# Altium schematic sheet Other_Componentt.SchDoc
size A4; Date: 14.09.2021; Author: İzzet Emre KARSAVURAN; Revision: 1; SheetNumber: 2; SheetTotal: 5; Authot_Mail: iekarsavuran@gmail.com; Project_Name: Burglar Alarm System; Size: A3
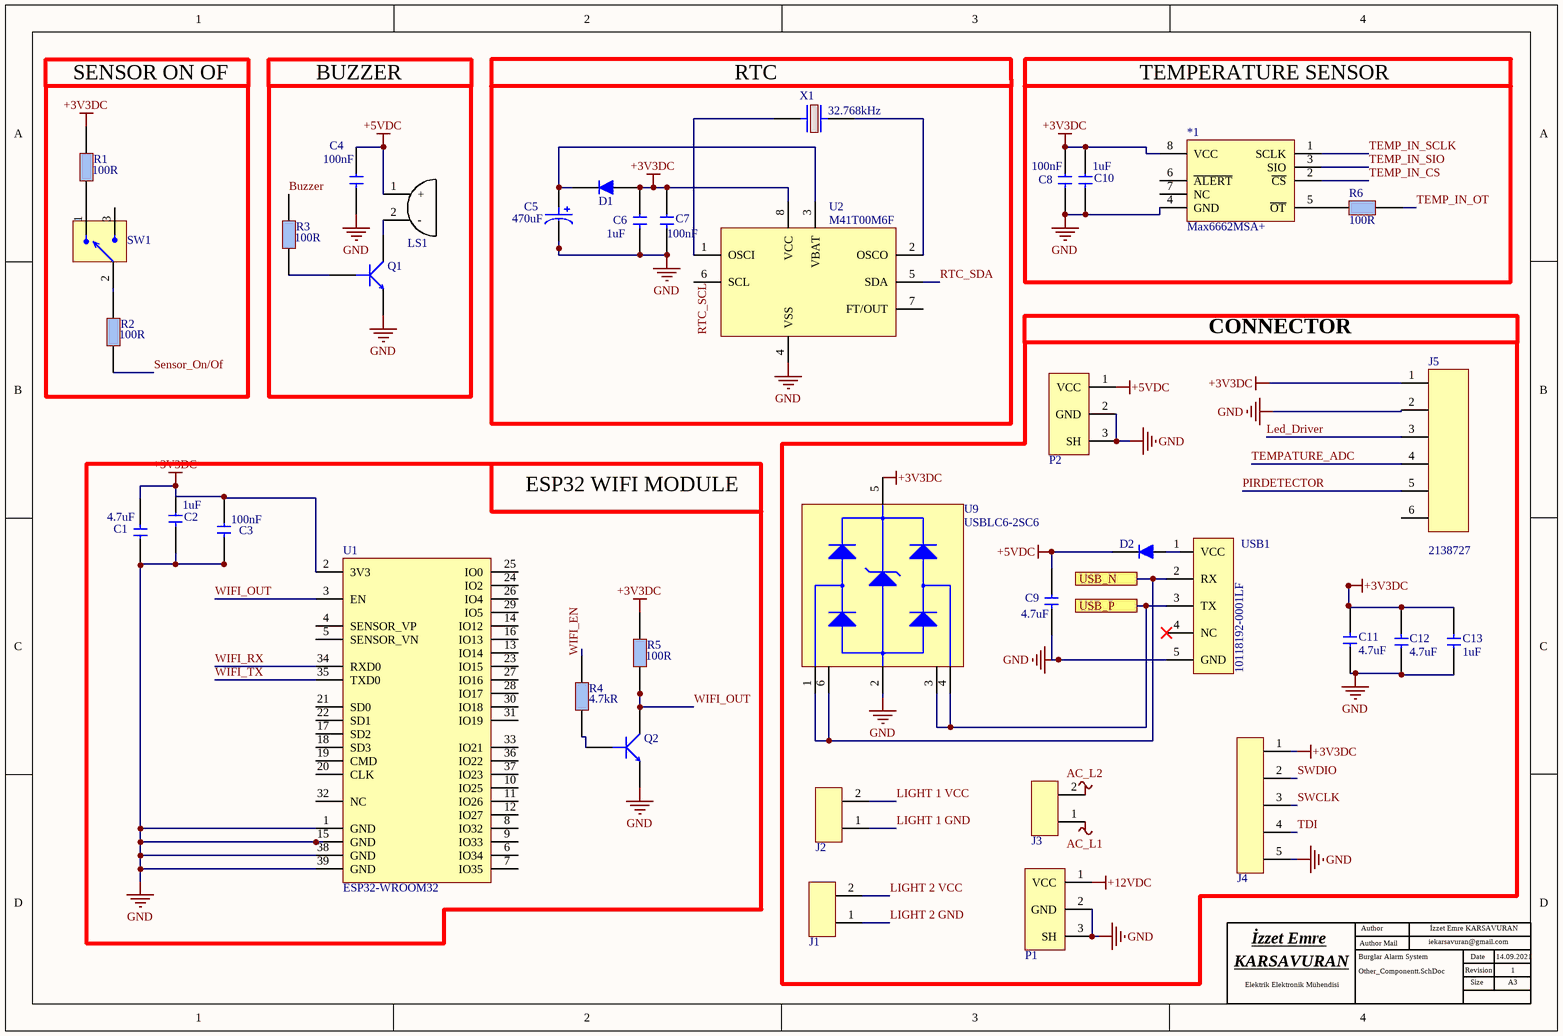
[diagram p0: Other_Componentt.SchDoc]

## Parts
*1  Max6662MSA+  [SOIC8]
C1  Capacitance: 4.7uF  [CAP_0805]  (hidden comment: CL21A475KAQNNNE)
C2  Capacitance: 1uF  [CAP_0805]  (hidden comment: CL21B105KBFNNNE)
C3  Capacitance: 100nF  [CAP_0805]  (hidden comment: CL21B104KBCNNNC)
C4  Capacitance: 100nF  [CAP_0805]  (hidden comment: CL21B104KBCNNNC)
C5  Capacitance: 470uF  [CAP_RADIAL_D10_P5]  (hidden comment: ESH477M050AH4AA)
C6  Capacitance: 1uF  [CAP_0805]  (hidden comment: CL21B105KBFNNNE)
C7  Capacitance: 100nF  [CAP_0805]  (hidden comment: CL21B104KBCNNNC)
C8  Capacitance: 100nF  [CAP_0805]  (hidden comment: CL21B104KBCNNNC)
C9  Capacitance: 4.7uF  [CAP_0805]  (hidden comment: CL21A475KAQNNNE)
C10  Capacitance: 1uF  [CAP_0805]  (hidden comment: CL21B105KBFNNNE)
C11  Capacitance: 4.7uF  [CAP_0805]  (hidden comment: CL21A475KAQNNNE)
C12  Capacitance: 4.7uF  [CAP_0805]  (hidden comment: CL21A475KAQNNNE)
C13  Capacitance: 1uF  [CAP_0805]  (hidden comment: CL21B105KBFNNNE)
D1  1N4148WS  [SOT23-F]  (value not drawn)
D2  1N4148WS  [SOT23-F]  (value not drawn)
J1  TBP01R1-508-02BE  [TBP01R1-508]  (value not drawn)
J2  TBP01R1-508-02BE  [TBP01R1-508]  (value not drawn)
J3  TBP01R1-508-02BE  [TBP01R1-508]  (value not drawn)
J4  SMH-105-02-L-S  [PINHEADER1X5_RA]  (value not drawn)
J5  Supplier Part Number 1: 2138727  [64800611622]  (hidden comment: 64800611622)
LS1  CMI-9605IC-0580T  [CMI-9605IC-0580T]  (value not drawn)
P1  PJ-037AH-SMT-TR  [JACK]  (value not drawn)
P2  PJ-037AH-SMT-TR  [JACK]  (value not drawn)
Q1  MMBT3904-7-F  [SOT23-F]  (value not drawn)
Q2  MMBT3904-7-F  [SOT23-F]  (value not drawn)
R1  Resistance: 100R  [RES_0603]  (hidden comment: RC0603JR-07100RL)
R2  Resistance: 100R  [RES_0603]  (hidden comment: RC0603JR-07100RL)
R3  Resistance: 100R  [RES_0603]  (hidden comment: RC0603JR-07100RL)
R4  Resistance: 4.7kR  [RES_0603]  (hidden comment: RC0603JR-074K7L)
R5  Resistance: 100R  [RES_0603]  (hidden comment: RC0603JR-07100RL)
R6  Resistance: 100R  [RES_0603]  (hidden comment: RC0603JR-07100RL)
SW1  EG1215AA  [EG1215AA]  (value not drawn)
U1  ESP32-WROOM32  [ESP-32]
U2  M41T00M6F  [SOIC8]
U9  USBLC6-2SC6  [SOT23-6L]
USB1  10118192-0001LF  [Micro_Usb_B]
X1  Frequency: 32.768kHz  [ABS05]  (hidden comment: ABS05-32.768KHZ-T)

## Blocks framed on the sheet
SENSOR ON OF: R1 R2 SW1
BUZZER: C4 LS1 Q1 R3
TEMPERATURE SENSOR: *1 C8 C10 R6
CONNECTOR: C9 C11-C13 D2 J1-J5 P1 P2 U9 USB1
ESP32 WIFI MODULE: C1-C3 Q2 R4 R5 U1

## Ports
USB_N, USB_P

## Nets
+3V3DC: *1.8(VCC) C1.2 C2.1 C3.1 C6.1 C7.1 C8.1 C10.1 C11.2 C12.2 C13.2 D1.2 J4.1 J5.1 R1.2 R5.2 U1.2(3V3) U2.8(VCC) U9.5(VBUS)
+5VDC: C4.1 C9.1 D2.1 LS1.1(+) P2.1(VCC)
+12VDC: P1.1(VCC)
AC_L1: J3.1
AC_L2: J3.2
GND: *1.4(GND) C1.1 C2.2 C3.2 C4.2 C5.2 C6.2 C7.2 C8.2 C9.2 C10.2 C11.1 C12.1 C13.1 J4.5 J5.2 P1.2(GND) P1.3(SH) P2.2(GND) P2.3(SH) Q1.2(E) Q2.2(E) U1.1(GND) U1.15(GND) U1.38(GND) U1.39(GND) U2.4(VSS) U9.2(GND) USB1.5(GND)
Buzzer: R3.2
Led_Driver: J5.3
LIGHT 1 GND: J2.1
LIGHT 1 VCC: J2.2
LIGHT 2 GND: J1.1
LIGHT 2 VCC: J1.2
PIRDETECTOR: J5.5
RTC_SCL: U2.6(SCL)
RTC_SDA: U2.5(SDA)
Sensor_On/Of: R2.1
SWCLK: J4.3
SWDIO: J4.2
TDI: J4.4
TEMP_IN_CS: *1.2(~{CS})
TEMP_IN_OT: R6.1
TEMP_IN_SCLK: *1.1(SCLK)
TEMP_IN_SIO: *1.3(SIO)
TEMPATURE_ADC: J5.4
USB_N: U9.1(I/O1) U9.6(I/O1) USB1.2(RX) ; port USB_N
USB_P: U9.3(I/O2) U9.4(I/O2) USB1.3(TX) ; port USB_P
WIFI_EN: R4.2
WIFI_OUT: Q2.3(C) R5.1 U1.3(EN)
WIFI_RX: U1.34(RXD0)
WIFI_TX: U1.35(TXD0)
Net*1_5: *1.5(~{OT}) R6.2
NetC5_1: C5.1 D1.1 U2.3(VBAT)
NetD2_2: D2.2 USB1.1(VCC)
NetLS1_2: LS1.2(-) Q1.3(C)
NetQ1_1: Q1.1(B) R3.1
NetQ2_1: Q2.1(B) R4.1
NetR1_1: R1.1 SW1.1
NetR2_2: R2.2 SW1.2
NetU2_1: U2.1(OSCI) X1.1
NetU2_2: U2.2(OSCO) X1.2

Not connected (* = marked no-connect by the designer): *1 6(~{ALERT}) 7(NC); J5 6; SW1 3; U1 4(SENSOR_VP) 5(SENSOR_VN) 6(IO34) 7(IO35) 8(IO32) 9(IO33) 10(IO25) 11(IO26) 12(IO27) 13(IO14) 14(IO12) 16(IO13) 17(SD2) 18(SD3) 19(CMD) 20(CLK) 21(SD0) 22(SD1) 23(IO15) 24(IO2) 25(IO0) 26(IO4) 27(IO16) 28(IO17) 29(IO5) 30(IO18) 31(IO19) 32(NC) 33(IO21) 36(IO22) 37(IO23); U2 7(FT/OUT); USB1 4(NC)*

## Notes on the sheet
- (near X1) RTC
- KARSAVURAN <https://github.com/iek21?>
- Elektrik Elektronik Mühendisi
- İzzet Emre <https://www.linkedin.com/in/izzet-emre-karsavuran-24704417b>
- Author Mail
- Author
- Revision
- Date
- Size

## Library data of the parts
*1 = Max6662MSA+: Temp Sensor Digital Serial (3-Wire, SPI) 8-Pin SOIC N Tube; Manufacturer: Maxim; Designed By: İzzet Emre KARSAVURAN; Output Type: Digital,SPI; Max Supply Voltage (DC): 5.5V; Min Supply Voltage (DC): 3V; Resolution: 12b; Max Power Dissipation: 471mW; Operating Supply Current: 600uA; Number of Bits: 12; Package: SOIC8; Supplier 1: Digi-Key; Manufacturer Part Number: MAX6662MSA+; RoHS: Yes; Category: Temperature and Humidity Sensors; Stock 1: 649; Pricing 1: 1=3,20000, 10=2,87000, 25=2,71360, 100=2,35170, 500=2,00196, 1000=1,78220 (USD); Case/Package: SOIC; Number of Pins: 8; Min Operating Temperature: -55°C; Max Operating Temperature: 150°C; Interface: SPI; Packaging: Rail/Tube; Package Quantity: 100; Series: MAX6662; Max Supply Voltage: 5.5V; Min Supply Voltage: 3V; Length: 5mm; Width: 4mm; Height: 1.5mm; Radiation Hardening: No; RoHS Compliant: Yes; Lead Free: Lead Free; REACH SVHC: Unknown; ComponentLink1URL: https://datasheet.ciiva.com/5299/max6662-89142-5299456.pdf?src-supplier=Mouser; ComponentLink1Description: https://datasheet.ciiva.com/5299/max6662-89142-5299456.pdf?src-supplier=Mouser; ComponentLink2URL: https://datasheet.ciiva.com/16635/max6662-16635842.pdf?src-supplier=Avnet+Europe; ComponentLink2Description: https://datasheet.ciiva.com/16635/max6662-16635842.pdf?src-supplier=Avnet+Europe; ComponentLink3URL: https://datasheet.ciiva.com/3277/max6662-3277979.pdf?src-supplier=Avnet; ComponentLink3Description: https://datasheet.ciiva.com/3277/max6662-3277979.pdf?src-supplier=Avnet; ComponentLink4URL: https://datasheet.ciiva.com/2003/max6662-2003390.pdf?src-supplier=Digi-Key; ComponentLink4Description: https://datasheet.ciiva.com/2003/max6662-2003390.pdf?src-supplier=Digi-Key; Supplier Part Number 1: MAX6662MSA+-ND
C1 C9 C11 C12 = CAP CER 4.7uF: SAMSUNG ELECTRO-MECHANICS - CL21A475KAQNNNE - SMD Multilayer Ceramic Capacitor, 4.7 µF, 25 V, 0805 [2012 Metric], ± 10%, X5R, CL Series; Designed By: İzzet Emre KARSAVURAN; Voltage Rating: 25V; Supplier 1: Digi-Key; Manufacturer: Samsung; Manufacturer Part Number: CL21A475KAQNNNE; RoHS: Yes; Category: Ceramic Capacitors; Stock 1: 340871; Pricing 1: 1=0,12000, 10=0,08300, 50=0,04720, 100=0,03910, 500=0,02742, 1000=0,02271 (USD); Mount: Surface Mount; Case/Package: 0805; Case Code (Metric): 2012; Case Code (Imperial): 0805; Min Operating Temperature: -55°C; Max Operating Temperature: 85°C; Package Quantity: 1; Packaging: Tape and Reel; Tolerance: 10%; Dielectric: X5R; Voltage Rating (DC): 25V; Series: CL; Construction: Flat; Length: 2mm; Width: 0.049inch; Height: 1.25mm; Thickness: 0.055inch; Depth: 1.25mm; Radiation Hardening: No; Lead Free: Lead Free; RoHS Compliant: Yes; ComponentLink1URL: https://datasheet.ciiva.com/25798/cl21a475kaqnnne-25798882.pdf?src-supplier=Digi-Key; ComponentLink1Description: https://datasheet.ciiva.com/25798/cl21a475kaqnnne-25798882.pdf?src-supplier=Digi-Key; Supplier Part Number 1: 1276-1244-1-ND
C2 C6 C10 C13 = CAP CER 1uF: SAMSUNG ELECTRO-MECHANICS - CL21B105KBFNNNE - SMD Multilayer Ceramic Capacitor, 1 µF, 50 V, 0805 [2012 Metric], ± 10%, X7R, CL Series; Designed By: İzzet Emre KARSAVURAN; Voltage Rating: 50V; Supplier 1: Digi-Key; Manufacturer: Samsung; Manufacturer Part Number: CL21B105KBFNNNE; RoHS: Yes; Category: Ceramic Capacitors; Pricing 1: 1=0,13000, 10=0,09000, 50=0,05120, 100=0,04250, 500=0,02978, 1000=0,02465 (USD); Mount: Surface Mount; Case/Package: 0805; Case Code (Metric): 2012; Case Code (Imperial): 0805; Min Operating Temperature: -55°C; Max Operating Temperature: 125°C; Tolerance: 10%; Packaging: Tape and Reel; Package Quantity: 1; Dielectric: X7R; Voltage: 50V; Series: CL; Construction: Flat; Length: 2mm; Width: 0.049inch; Height: 1.25mm; Thickness: 0.053inch; Depth: 1.25mm; Radiation Hardening: No; RoHS Compliant: Yes; ComponentLink1URL: https://datasheet.ciiva.com/25800/cl21b105kbfnnne-25800291.pdf?src-supplier=Digi-Key; ComponentLink1Description: https://datasheet.ciiva.com/25800/cl21b105kbfnnne-25800291.pdf?src-supplier=Digi-Key; ComponentLink2URL: https://datasheet.ciiva.com/16449/cl21b105kbfnnne-16449003.pdf?src-supplier=Future+Electronics; ComponentLink2Description: https://datasheet.ciiva.com/16449/cl21b105kbfnnne-16449003.pdf?src-supplier=Future+Electronics; ComponentLink3URL: https://datasheet.ciiva.com/26838/getdatasheetpartid-354075-26838668.pdf?src-supplier=Verical; ComponentLink3Description: https://datasheet.ciiva.com/26838/getdatasheetpartid-354075-26838668.pdf?src-supplier=Verical; Supplier Part Number 1: 1276-1029-6-ND
C3 C4 C7 C8 = CAP CER 100nF-0803: Samsung Electro-Mechanics 100nF Multilayer Ceramic Capacitor (MLCC) 50 V 10% X7R dielectric CL max op. temp. +125C; Designed By: İzzet Emre KARSAVURAN; Voltage Rating: 50V; Supplier 1: Digi-Key; Manufacturer: Samsung; Manufacturer Part Number: CL21B104KBCNNNC; RoHS: Yes; Category: Ceramic Capacitors; Pricing 1: 1=0,10000, 10=0,05000, 50=0,02740, 100=0,02240, 500=0,01598, 1000=0,01256 (USD); Mount: Surface Mount; Case/Package: 0805; Case Code (Metric): 2012; Case Code (Imperial): 0805; Material: Ceramic; Contact Plating: Tin; Min Operating Temperature: -55°C; Max Operating Temperature: 125°C; Tolerance: 10%; Dielectric: X7R; Packaging: Tape and Reel; Voltage: 50V; Voltage Rating (DC): 50V; Series: CL; Construction: Flat; Length: 2mm; Width: 0.049inch; Height: 0.85mm; Depth: 1.25mm; Thickness: 0.037inch; Radiation Hardening: No; Lead Free: Lead Free; RoHS Compliant: Yes; ComponentLink1URL: https://datasheet.ciiva.com/25710/cl21b104kbcnnnc-25710182.pdf?src-supplier=Digi-Key; ComponentLink1Description: https://datasheet.ciiva.com/25710/cl21b104kbcnnnc-25710182.pdf?src-supplier=Digi-Key; ComponentLink2URL: https://datasheet.ciiva.com/29199/454152-da-01-en-vs-kondensator-0805-29199814.pdf?src-supplier=Conrad; ComponentLink2Description: https://datasheet.ciiva.com/29199/454152-da-01-en-vs-kondensator-0805-29199814.pdf?src-supplier=Conrad; Supplier Part Number 1: 1276-1003-6-ND
C5 = CAP ALU ELEC 470uF 50V: Cap, 470UF, 50V, Alu Elec, Radial; Manufacturer: KEMET; Polarity: Polar; Tolerance: 20%; Life (Hours): 2000Hour; Designed By: İzzet Emre KARSAVURAN; Supplier 1: Digi-Key; Manufacturer Part Number: ESH477M050AH4AA; RoHS: Yes; Pricing 1: 1=0,59000, 10=0,41700, 50=0,31540, 100=0,27470, 500=0,20350, 1000=0,17298, 2500=0,16280, 5000=0,15262 (USD); Mount: Through Hole; Case/Package: Radial; Min Operating Temperature: -40°C; Max Operating Temperature: 105°C; Packaging: Bulk; Voltage Rating: 50V; RoHS Compliant: No; ComponentLink1URL: https://api.kemet.com/component-edge/download/datasheet/ESH477M050AH4AA.pdf?src-supplier=Digi-Key; ComponentLink1Description: https://api.kemet.com/component-edge/download/datasheet/ESH477M050AH4AA.pdf?src-supplier=Digi-Key; Supplier Part Number 1: 399-15683-ND
D1 D2 = 1N4148WS: ON SEMICONDUCTOR - 1N4148WS - Small Signal Diode, Single, 75 V, 150 mA, 1 V, 4 ns; Manufacturer: ON Semiconductor / Fairchild; Designed By: İzzet Emre KARSAVURAN; Forward Current: 150mA; Max Repetitive Reverse Voltage (Vrrm): 75V; Forward Voltage: 1V; Reverse Recovery Time: 4ns; Power Dissipation: 200mW; Max Reverse Current: 5uA; Max Forward Surge Current (Ifsm): 2A; Supplier 1: Digi-Key; Manufacturer Part Number: 1N4148WS; RoHS: Yes; Category: Rectifier Diodes; Pricing 1: 1=0,21000, 10=0,19200, 100=0,10460, 500=0,06436, 1000=0,04388 (USD); Mount: Surface Mount; Number of Pins: 2; Contact Plating: Tin,Matte; Weight: 0.0276g; Min Operating Temperature: -55°C; Max Operating Temperature: 150°C; Packaging: Tape and Reel; Element Configuration: Single; Package Quantity: 1; Average Rectified Current: 150mA; Max Reverse Voltage (DC): 75V; Recovery Time: 4ns; Series: -; Reverse Voltage: 75V; Length: 1.8mm; Width: 1.35mm; Height: 1mm; Radiation Hardening: No; RoHS Compliant: Yes; REACH SVHC: No SVHC; Lead Free: Lead Free; ComponentLink1URL: https://datasheet.ciiva.com/25968/1n914bws-25968945.pdf?src-supplier=Avnet+Europe; ComponentLink1Description: https://datasheet.ciiva.com/25968/1n914bws-25968945.pdf?src-supplier=Avnet+Europe; ComponentLink2URL: https://datasheet.ciiva.com/30479/0900766b810e1cd3-30479206.pdf?src-supplier=RSComponents; ComponentLink2Description: https://datasheet.ciiva.com/30479/0900766b810e1cd3-30479206.pdf?src-supplier=RSComponents; ComponentLink3URL: https://datasheet.ciiva.com/8300/1n914bws-8300360.pdf?src-supplier=Avnet; ComponentLink3Description: https://datasheet.ciiva.com/8300/1n914bws-8300360.pdf?src-supplier=Avnet; ComponentLink4URL: https://datasheet.ciiva.com/15208/getdatasheetpartid-127819-15208358.pdf?src-supplier=Verical; ComponentLink4Description: https://datasheet.ciiva.com/15208/getdatasheetpartid-127819-15208358.pdf?src-supplier=Verical; ComponentLink5URL: https://datasheet.ciiva.com/910/1n4148ws-910381.pdf?src-supplier=Digi-Key; ComponentLink5Description: https://datasheet.ciiva.com/910/1n4148ws-910381.pdf?src-supplier=Digi-Key; ComponentLink6URL: https://datasheet.ciiva.com/910/1n4148ws-910382.pdf?src-supplier=Digi-Key; ComponentLink6Description: https://datasheet.ciiva.com/910/1n4148ws-910382.pdf?src-supplier=Digi-Key; ComponentLink7URL: https://datasheet.ciiva.com/910/1n4148ws-910380.pdf?src-supplier=Digi-Key; ComponentLink7Description: https://datasheet.ciiva.com/910/1n4148ws-910380.pdf?src-supplier=Digi-Key; Case/Package: SOC323F; Supplier Part Number 1: 1N4148WSFSCT-ND
J1-J3 = TBP01R1-508-02BE: Conn Shrouded Header HDR 2 POS 5.08mm Solder RA Side Entry Thru-Hole Bag; Manufacturer: CUI; Designed By: İzzet Emre KARSAVURAN; Supplier 1: Future Electronics; Manufacturer Part Number: TBP01R1-508-02BE; RoHS: Yes; Supplier Part Number 1: 1117528; Case/Package: TBP01R1-508
J4 = SMH-105-02-L-S: .100 C.L. HORIZONTAL SMT SOCKET; Manufacturer: Samtec; Designed By: İzzet Emre KARSAVURAN; Number of Contacts: 4; Gender: Receptacle; Contact Resistance: 10mR; Pitch: 2.54mm; Supplier 1: Digi-Key; Manufacturer Part Number: SMH-105-02-L-S; RoHS: Yes; Category: Headers and Wire Housings; Pricing 1: 1=2,01000, 10=1,75200, 80=1,56550, 440=1,30464, 945=1,11825, 4900=0,99400 (USD); Contact Plating: Gold; Contact Material: Bronze; Housing Color: Black; Housing Material: Polymer; Min Operating Temperature: -55°C; Max Operating Temperature: 125°C; Number of Rows: 1; Termination: Solder; Packaging: Rail/Tube; Orientation: Horizontal; Length: 13.21mm; Depth: 10.8mm; Radiation Hardening: No; REACH SVHC: No SVHC; ComponentLink1URL: http://components.arrow.com/part/dataview/0323_04802604?src-supplier=Arrow+Europe; ComponentLink1Description: http://components.arrow.com/part/dataview/0323_04802604?src-supplier=Arrow+Europe; ComponentLink2URL: http://www.farnell.com/datasheets/1927708.pdf?_ga=2.237598468.569325269.1503285096-1413671594.1503025027&src-supplier=Farnell; ComponentLink2Description: http://www.farnell.com/datasheets/1927708.pdf?_ga=2.237598468.569325269.1503285096-1413671594.1503025027&src-supplier=Farnell; ComponentLink3URL: ftp://ftp.samtec.com/webfiles/PDF/SMH.PDF?src-supplier=Avnet+Europe; ComponentLink3Description: ftp://ftp.samtec.com/webfiles/PDF/SMH.PDF?src-supplier=Avnet+Europe; ComponentLink4URL: http://www.samtec.com/documents/webfiles/pdf/SMH.PDF?src-supplier=Newark; ComponentLink4Description: http://www.samtec.com/documents/webfiles/pdf/SMH.PDF?src-supplier=Newark; ComponentLink5URL: http://www.samtec.com/documents/webfiles/pdf/SMH.PDF?src-supplier=Avnet; ComponentLink5Description: http://www.samtec.com/documents/webfiles/pdf/SMH.PDF?src-supplier=Avnet; ComponentLink6URL: http://suddendocs.samtec.com/catalog_english/smh.pdf?src-supplier=Digi-Key; ComponentLink6Description: http://suddendocs.samtec.com/catalog_english/smh.pdf?src-supplier=Digi-Key; Supplier Part Number 1: SAM11813-ND; Case/Package: PINHEADER1X5_RA
J5 = 64800611622_conn_6pin: Manufacturer: Wurth Electronics; Designed By: İzzet Emre KARSAVURAN; Supplier 1: RSComponents; Manufacturer Part Number: 64800611622; RoHS: No; Stock 1: 160; Pricing 1: 10=0,39600, 50=0,36600, 200=0,34000, 500=0,31800 (GBP)
LS1 = CMI-9605IC-0580T: Buzzers Indicator, Internally Driven Magnetic 5 V 30mA 2.7kHz 80dB @ 5V, 10cm Through Hole PC Pins; Designed By: İzzet Emre Karsavuran; Max Supply Voltage: 7; Min Supply Voltage: 3; rated frequency min: 2,600; rated frequency  typ: 2,700; rated frequency max: 2,800; Min Operating Temperature: -40; Max Operating Temperature: 85; ComponentLink1Description: Link; ComponentLink1URL: https://www.cuidevices.com/product/resource/cmi-9605ic-0580t.pdf; Case/Package: CMI-9605IC-0580T
P1 P2 = PJ-037AH-SMT-TR: DC Power Connectors Power Jacks; Manufacturer: CUI; Designed By: İzzet Emre KARSAVURAN; Number of Conductors: 2; Gender: Male; Shielding: Unshielded; Current Rating: 5A; Voltage Rating: 24V; Insulation Resistance: 100MR; Supplier 1: Digi-Key; Manufacturer Part Number: PJ-037AH-SMT-TR; RoHS: Yes; Category: Connectors; Mount: Surface Mount,Through Hole; Case/Package: SMD/SMT; Color: Black; Contact Material: Copper; Contact Plating: Nickel; Housing Color: Black; Housing Material: Thermoplastic; Min Operating Temperature: -25°C; Max Operating Temperature: 85°C; Orientation: Horizontal; Package Quantity: 200; Termination: Solder; Connector Type: Jack; Contact Gender: Male; Packaging: Tape and Reel; Flammability Rating: UL94 V-0; ComponentLink1URL: http://www.mouser.com/ds/2/670/pj-037ah-smt-516065.pdf?src-supplier=Mouser; ComponentLink1Description: http://www.mouser.com/ds/2/670/pj-037ah-smt-516065.pdf?src-supplier=Mouser; ComponentLink2URL: https://www.cui.com/product/resource/digikeypdf/pj-037ah-smt-tr.pdf?src-supplier=Digi-Key; ComponentLink2Description: https://www.cui.com/product/resource/digikeypdf/pj-037ah-smt-tr.pdf?src-supplier=Digi-Key; ComponentLink3URL: http://www.cui.com/product/resource/digikeypdf/pj-037ah-smt.pdf?src-supplier=Digi-Key; ComponentLink3Description: http://www.cui.com/product/resource/digikeypdf/pj-037ah-smt.pdf?src-supplier=Digi-Key; Supplier Part Number 1: CP-037AHPJCT-ND
Q1 Q2 = MMBT3904-7-F: TRANS NPN 40V 0.2A SMD SOT23-3; Manufacturer: Diodes Zetex; Max Power Dissipation: 300mW; Max Collector Current: 200mA; Collector Base Voltage (VCBO): 60V; Frequency: 300MHz; hFE Min: 100; Number of Elements: 1; Emitter Base Voltage (VEBO): 6V; Collector Emitter Saturation Voltage: 300mV; Power Dissipation: 350mW; Element Configuration: Single; Designed By: İzzet Emre KARSAVURAN; Supplier 1: Digi-Key; Manufacturer Part Number: MMBT3904-7-F; RoHS: Yes; Category: BJTs; Pricing 1: 1=0,13000, 10=0,11700, 100=0,06370, 500=0,03918, 1000=0,02671 (USD); Mount: Surface Mount; Case/Package: SOT-23; Number of Pins: 3; Weight: 0.000282oz; Contact Plating: Tin,Matte; Min Operating Temperature: -55°C; Max Operating Temperature: 150°C; Collector Emitter Voltage (VCEO): 40V; Polarity: NPN; Packaging: Tape and Reel; Package Quantity: 3000; Transition Frequency: 300MHz; Collector Emitter Breakdown Voltage: 40V; Max Breakdown Voltage: 40V; Continuous Collector Current: 200mA; Max Frequency: 300MHz; Gain Bandwidth Product: 300MHz; Series: -; Collector-emitter Voltage-Max: 300mV; Voltage Rating (DC): 40V; Length: 3.05mm; Width: 1.4mm; Height: 1mm; Radiation Hardening: No; REACH SVHC: No SVHC; Lead Free: Lead Free; RoHS Compliant: Yes; ComponentLink1URL: https://datasheet.ciiva.com/11201/ds30036-11201778.pdf?src-supplier=Avnet; ComponentLink1Description: https://datasheet.ciiva.com/11201/ds30036-11201778.pdf?src-supplier=Avnet; ComponentLink2URL: https://datasheet.ciiva.com/15138/getdatasheetpartid-53265-15138780.pdf?src-supplier=Verical; ComponentLink2Description: https://datasheet.ciiva.com/15138/getdatasheetpartid-53265-15138780.pdf?src-supplier=Verical; ComponentLink3URL: https://datasheet.ciiva.com/22711/1915516-22711750.pdf?src-supplier=Element14; ComponentLink3Description: https://datasheet.ciiva.com/22711/1915516-22711750.pdf?src-supplier=Element14; ComponentLink4URL: https://datasheet.ciiva.com/11198/ds30036-11198999.pdf?src-supplier=Avnet; ComponentLink4Description: https://datasheet.ciiva.com/11198/ds30036-11198999.pdf?src-supplier=Avnet; ComponentLink5URL: https://datasheet.ciiva.com/6361/ds30036-6361256.pdf?src-supplier=Digi-Key; ComponentLink5Description: https://datasheet.ciiva.com/6361/ds30036-6361256.pdf?src-supplier=Digi-Key; ComponentLink6URL: https://datasheet.ciiva.com/6361/ds30036-6361254.pdf?src-supplier=Digi-Key; ComponentLink6Description: https://datasheet.ciiva.com/6361/ds30036-6361254.pdf?src-supplier=Digi-Key; Supplier Part Number 1: MMBT3904-FDIDKR-ND
R1-R3 R5 R6 = RES 100 OHM: Res Thick Film 0603 100 Ohm 5% 0.1W(1/10W) ±100ppm/C Molded SMD Paper T/R; Manufacturer: Yageo; Designed By: İzzet Emre KARSAVURAN; Temperature Coefficient: 100ppm/°C; Voltage Rating (DC): 50V; Power Rating: 100mW; Supplier 1: Digi-Key; Manufacturer Part Number: RC0603JR-07100RL; RoHS: Yes; Category: Chip SMD Resistors; Stock 1: 1295481; Pricing 1: 1=0,10000, 10=0,02000, 100=0,00800, 1000=0,00360, 2500=0,00312 (USD); Case/Package: 0603; Number of Pins: 2; Contact Plating: Tin,Matte; Case Code (Imperial): 0603; Case Code (Metric): 1608; Size Code: 0603; Min Operating Temperature: -55°C; Max Operating Temperature: 155°C; Tolerance: 5%; Resistor Type: Thick Film; Packaging: Tape and Reel; Voltage Rating: 50V; Termination: SMD/SMT; Features: Moisture Resistant; Series: RC; Max Power Dissipation: 100mW; Number of Terminations: 2; Construction: Rectangular; Resistance Tolerance: 5%; Length: 1.6mm; Width: 0.8mm; Depth: 0.8mm; Radiation Hardening: No; REACH SVHC: Unknown; Lead Free: Lead Free; Military Standard: Not; RoHS Compliant: Yes; ComponentLink1URL: https://datasheet.ciiva.com/7746/443971-7746425.pdf?src-supplier=Element14; ComponentLink1Description: https://datasheet.ciiva.com/7746/443971-7746425.pdf?src-supplier=Element14; ComponentLink2URL: https://datasheet.ciiva.com/7746/443971-7746426.pdf?src-supplier=Element14; ComponentLink2Description: https://datasheet.ciiva.com/7746/443971-7746426.pdf?src-supplier=Element14; ComponentLink3URL: https://datasheet.ciiva.com/8883/pyu-rc0603-51-rohs-l-4-8883047.pdf?src-supplier=Avnet; ComponentLink3Description: https://datasheet.ciiva.com/8883/pyu-rc0603-51-rohs-l-4-8883047.pdf?src-supplier=Avnet; ComponentLink4URL: https://datasheet.ciiva.com/15189/getdatasheetpartid-325207-15189846.pdf?src-supplier=Verical; ComponentLink4Description: https://datasheet.ciiva.com/15189/getdatasheetpartid-325207-15189846.pdf?src-supplier=Verical; Supplier Part Number 1: 311-100GRCT-ND
R4 = RES 47k OHM: Res Thick Film 0603 4.7K Ohm 5% 0.1W(1/10W) ±100ppm/C Molded SMD Paper T/R; Manufacturer: Yageo; Designed By: İzzet Emre KARSAVURAN; Temperature Coefficient: 100ppm/°C; Voltage Rating (DC): 50V; Power Rating: 100mW; Supplier 1: Digi-Key; Manufacturer Part Number: RC0603JR-074K7L; RoHS: Yes; Category: Chip SMD Resistors; Stock 1: 1969134; Pricing 1: 1=0,10000, 10=0,02000, 100=0,00800, 1000=0,00360, 2500=0,00312 (USD); Case/Package: 0603; Number of Pins: 2; Case Code (Imperial): 0603; Case Code (Metric): 1608; Size Code: 0603; Min Operating Temperature: -55°C; Max Operating Temperature: 155°C; Resistor Type: Thick Film; Tolerance: 5%; Packaging: Tape and Reel; Voltage Rating: 50V; Termination: SMD/SMT; Features: Moisture Resistant; Max Power Dissipation: 100mW; Number of Terminations: 2; Series: RC; Resistance Tolerance: 5%; Construction: Rectangular; Length: 1.6mm; Width: 0.8mm; Depth: 0.8mm; REACH SVHC: No SVHC; Lead Free: Lead Free; RoHS Compliant: Yes; Military Standard: Not; ComponentLink1URL: https://datasheet.ciiva.com/46412/443971-46412858.pdf?src-supplier=Element14; ComponentLink1Description: https://datasheet.ciiva.com/46412/443971-46412858.pdf?src-supplier=Element14; Supplier Part Number 1: 311-4.7KGRCT-ND
SW1 = EG1215AA: Slide Switch, SPDT, 0.025A, 24V, SMD; Manufacturer: E-Switch; Designed By: İzzet Emre KARSAVURAN; Mechanical Life: 10000Cycles; Switch Function: On-On; Current Rating: 25mA; Actuator Type: Standard; Switch Travel: 1.5mm; Operating Force: 150gf; Zener Voltage: 9.1V; Tolerance: 4.95%; Max Power Dissipation: 5W; Impedance: 2R; Actuator Length: 1.4mm; Supplier 1: Digi-Key; Manufacturer Part Number: EG1215AA; RoHS: Yes; Stock 1: 3829; Pricing 1: 1=0,99000, 10=0,95100, 25=0,88840, 100=0,77150, 250=0,70200, 500=0,65080, 1000=0,60327 (USD); Mount: Surface Mount,Through Hole; Case/Package: Axial; Min Operating Temperature: -20°C; Max Operating Temperature: 175°C; Throw Configuration: SPDT; Packaging: Cut Tape; Voltage Rating (DC): 24V; Termination: Gull Wing; Electrical Life: 10000Cycles; ComponentLink1URL: https://media.digikey.com/pdf/Data%20Sheets/E-Switch%20PDFs/EG1215_Series_Ds.pdf?src-supplier=Digi-Key; ComponentLink1Description: https://media.digikey.com/pdf/Data%20Sheets/E-Switch%20PDFs/EG1215_Series_Ds.pdf?src-supplier=Digi-Key; ComponentLink2URL: http://www.farnell.com/datasheets/2645007.pdf?src-supplier=Farnell; ComponentLink2Description: http://www.farnell.com/datasheets/2645007.pdf?src-supplier=Farnell; Supplier Part Number 1: EG5720CT-ND; Package: EG1215AA
U1 = ESP32-WROOM32: • ESP32-D0WD-V3 embedded, Xtensa® dual-core / 32-bit LX6 microprocessor, up to 240 MHz / • 448 KB ROM for booting and core functions / • 520 KB SRAM for data and instructions / • 16 KB SRAM in RTC; Manufacturer: Espressif Systems; Manufacturer Part Number: ESP32-WROOM-32E(4MB); Designed By: İzzet Emre Karsavuran; Max Supply Voltage: 3.6V; Min Supply Voltage: 3V; Supplier 1: Digi-Key; RoHS: No; Pricing 1: 1=3,00000 (USD); Min Operating Temperature: -40; Max Operating Temperature: 85; ComponentLink1Description: datasheed; ComponentLink1URL: https://www.espressif.com/sites/default/files/documentation/esp32-wroom-32e_esp32-wroom-32ue_datasheet_en.pdf; Case/Package: ESP32
U2 = M41T00M6F: IC RTC CLK/CALENDAR I2C 8-SOIC; Manufacturer: STMicroelectronics; Logic Function: Clock; Time Format: HH:MM:SS; Max Supply Voltage: 5.5V; Min Supply Voltage: 2V; Non-volatile Memory Size: 8B; Interface: I2C,Serial,2-Wire; Date Format: YY-MM-DD-dd; Designed By: İzzet Emre Karsavuran; ComponentLink3Description: New link; ComponentLink3URL: *; Supplier 1: Digi-Key; Manufacturer Part Number: M41T00M6F; RoHS: Yes; Category: Memory; Pricing 1: 1=2,95000, 10=2,64900, 25=2,49880, 100=2,12890, 250=1,99896, 500=1,74908, 1000=1,65008 (USD); Mount: Surface Mount; Case/Package: SOIC; Number of Pins: 8; Weight: 0.019048oz; Min Operating Temperature: -40°C; Max Operating Temperature: 85°C; Packaging: Tape and Reel; Package Quantity: 2500; Memory Size: 8B; RAM Size: 8B; Series: M41T00; Supply Voltage-Nom: 5.5V; Length: 5mm; Width: 4mm; Height: 1.5mm; Radiation Hardening: No; REACH SVHC: No SVHC; Lead Free: Lead Free; Temperature Grade: INDUSTRIAL; RoHS Compliant: Yes; ComponentLink1URL: https://datasheet.ciiva.com/25889/cd00001542-25889923.pdf?src-supplier=Avnet+Europe; ComponentLink1Description: https://datasheet.ciiva.com/25889/cd00001542-25889923.pdf?src-supplier=Avnet+Europe; ComponentLink2URL: https://datasheet.ciiva.com/16213/cd00001542-16213654.pdf?src-supplier=Future+Electronics; ComponentLink2Description: https://datasheet.ciiva.com/16213/cd00001542-16213654.pdf?src-supplier=Future+Electronics; ComponentLink4URL: https://datasheet.ciiva.com/7630/1837112-7630077.pdf?src-supplier=Element14; ComponentLink4Description: https://datasheet.ciiva.com/7630/1837112-7630077.pdf?src-supplier=Element14; ComponentLink5URL: https://datasheet.ciiva.com/41459/001185345-da-01-en-ic-rtc-srl-512kbit-m41t00m6f-soic-8-stm-41459818.pdf?src-supplier=Conrad; ComponentLink5Description: https://datasheet.ciiva.com/41459/001185345-da-01-en-ic-rtc-srl-512kbit-m41t00m6f-soic-8-stm-41459818.pdf?src-supplier=Conrad; Package: SOIC8
U9 = USB PROTECTION: TVS DIODE 5.25V 17V SOT23-6; Manufacturer: STMicroelectronics; Designed By: İzzet Emre KARSAVURAN; Direction: Unidirectional,Bidirectional; Capacitance: 3.5pF; Operating Supply Voltage: 1.1V; Number of Channels: 2; Breakdown Voltage: 6V; Power Line Protection: Yes; Test Current: 1mA; Max Reverse Leakage Current: 150nA; Peak Pulse Current: 5A; Element Configuration: Dual; Data Rate: 480Mbps; Number of Elements: 1; Working Voltage: 5V; Supplier 1: Digi-Key; Manufacturer Part Number: USBLC6-2SC6; RoHS: Yes; Category: TVS Diodes; Pricing 1: 1=0,52000, 10=0,44800, 100=0,33450, 500=0,26282, 1000=0,20308 (USD); Mount: Surface Mount; Case/Package: SOT-23; Number of Pins: 6; Contact Plating: Tin,Matte; Min Operating Temperature: -40°C; Max Operating Temperature: 125°C; Clamping Voltage: 17V; Packaging: Tape and Reel; Package Quantity: 3000; Termination: SMD/SMT; Number of Bidirectional Channels: 2; Reverse Standoff Voltage: 5.25V; Min Breakdown Voltage: 6V; ESD Protection: Yes; Leakage Current: 150nA; Series: USB; Reverse Breakdown Voltage: 6V; Polarity: Unidirectional,Bidirectional; Max Breakdown Voltage: 6V; Clamping Voltage-Max: 17V; Length: 3.05mm; Width: 1.75mm; Height: 1.3mm; Depth: 1.75mm; Radiation Hardening: No; REACH SVHC: No SVHC; Lead Free: Lead Free; RoHS Compliant: Yes; ComponentLink1URL: https://datasheet.ciiva.com/1268/1690354-1268384.pdf?src-supplier=Element14; ComponentLink1Description: https://datasheet.ciiva.com/1268/1690354-1268384.pdf?src-supplier=Element14; ComponentLink2URL: https://datasheet.ciiva.com/4508/cd00050750-113117-4508433.pdf?src-supplier=Mouser; ComponentLink2Description: https://datasheet.ciiva.com/4508/cd00050750-113117-4508433.pdf?src-supplier=Mouser; ComponentLink3URL: https://datasheet.ciiva.com/15143/getdatasheetpartid-148465-15143789.pdf?src-supplier=Verical; ComponentLink3Description: https://datasheet.ciiva.com/15143/getdatasheetpartid-148465-15143789.pdf?src-supplier=Verical; ComponentLink4URL: https://datasheet.ciiva.com/26787/usblc6-2sc6-26787908.pdf?src-supplier=IIIC; ComponentLink4Description: https://datasheet.ciiva.com/26787/usblc6-2sc6-26787908.pdf?src-supplier=IIIC; ComponentLink5URL: https://datasheet.ciiva.com/16200/cd00050750-16200026.pdf?src-supplier=Future+Electronics; ComponentLink5Description: https://datasheet.ciiva.com/16200/cd00050750-16200026.pdf?src-supplier=Future+Electronics; ComponentLink6URL: https://datasheet.ciiva.com/41444/001184109-da-01-en-ic-esd-protecti-usblc6-2sc6-sot-23-6-stm-41444156.pdf?src-supplier=Conrad; ComponentLink6Description: https://datasheet.ciiva.com/41444/001184109-da-01-en-ic-esd-protecti-usblc6-2sc6-sot-23-6-stm-41444156.pdf?src-supplier=Conrad; Supplier Part Number 1: 497-5235-6-ND
USB1 = Micro B USB Connector: CONN USB MICRO B RECPT SMT R/A; Manufacturer: Amphenol ICC / FCI; Designed By: İzzet Emre KARSAVURAN; Supplier 1: Digi-Key; Manufacturer Part Number: 10118192-0001LF; RoHS: No; Category: USB Connectors; Stock 1: 75267; Pricing 1: 1=0,45000, 10=0,39700, 25=0,36240, 50=0,34120, 100=0,32700, 250=0,29856, 500=0,28434 (USD); ComponentLink1URL: http://components.arrow.com/part/dataview/0323_04107371?src-supplier=Arrow+Europe; ComponentLink1Description: http://components.arrow.com/part/dataview/0323_04107371?src-supplier=Arrow+Europe; ComponentLink2URL: http://uk.rs-online.com/webdocs/1450/0900766b814507ee.pdf?src-supplier=RSComponents; ComponentLink2Description: http://uk.rs-online.com/webdocs/1450/0900766b814507ee.pdf?src-supplier=RSComponents; ComponentLink3URL: https://cdn.amphenol-icc.com/media/wysiwyg/files/documentation/datasheet/inputoutput/io_usb_micro.pdf?src-supplier=Avnet; ComponentLink3Description: https://cdn.amphenol-icc.com/media/wysiwyg/files/documentation/datasheet/inputoutput/io_usb_micro.pdf?src-supplier=Avnet; ComponentLink4URL: https://cdn.amphenol-icc.com/media/wysiwyg/files/documentation/datasheet/inputoutput/io_usb_micro.pdf?src-supplier=Arrow+Electronics; ComponentLink4Description: https://cdn.amphenol-icc.com/media/wysiwyg/files/documentation/datasheet/inputoutput/io_usb_micro.pdf?src-supplier=Arrow+Electronics; ComponentLink5URL: https://cdn.amphenol-icc.com/media/wysiwyg/files/documentation/datasheet/inputoutput/io_usb_micro.pdf?src-supplier=Verical; ComponentLink5Description: https://cdn.amphenol-icc.com/media/wysiwyg/files/documentation/datasheet/inputoutput/io_usb_micro.pdf?src-supplier=Verical; ComponentLink6URL: http://portal.fciconnect.com/Comergent//fci/drawing/10118192.pdf?src-supplier=Avnet+Asia; ComponentLink6Description: http://portal.fciconnect.com/Comergent//fci/drawing/10118192.pdf?src-supplier=Avnet+Asia; ComponentLink7URL: https://cdn.amphenol-icc.com/media/wysiwyg/files/documentation/datasheet/inputoutput/io_usb_micro.pdf?src-supplier=Allied+Electronics; ComponentLink7Description: https://cdn.amphenol-icc.com/media/wysiwyg/files/documentation/datasheet/inputoutput/io_usb_micro.pdf?src-supplier=Allied+Electronics; ComponentLink8URL: http://www.farnell.com/datasheets/2366786.pdf?src-supplier=Newark; ComponentLink8Description: http://www.farnell.com/datasheets/2366786.pdf?src-supplier=Newark; ComponentLink9URL: https://cdn.amphenol-icc.com/media/wysiwyg/files/documentation/datasheet/inputoutput/io_usb_micro.pdf?src-supplier=Mouser; ComponentLink9Description: https://cdn.amphenol-icc.com/media/wysiwyg/files/documentation/datasheet/inputoutput/io_usb_micro.pdf?src-supplier=Mouser; ComponentLink10URL: http://www.amphenol-icc.com/media/wysiwyg/files/drawing/10118192.pdf?src-supplier=Digi-Key; ComponentLink10Description: http://www.amphenol-icc.com/media/wysiwyg/files/drawing/10118192.pdf?src-supplier=Digi-Key; ComponentLink11URL: http://www.farnell.com/cad/1935767.pdf?src-supplier=Element14; ComponentLink11Description: http://www.farnell.com/cad/1935767.pdf?src-supplier=Element14; ComponentLink12URL: http://www.farnell.com/datasheets/2366786.pdf?src-supplier=Farnell; ComponentLink12Description: http://www.farnell.com/datasheets/2366786.pdf?src-supplier=Farnell; ComponentLink13URL: https://cdn.amphenol-icc.com/media/wysiwyg/files/documentation/datasheet/inputoutput/io_usb_micro.pdf?src-supplier=TME; ComponentLink13Description: https://cdn.amphenol-icc.com/media/wysiwyg/files/documentation/datasheet/inputoutput/io_usb_micro.pdf?src-supplier=TME; ComponentLink14URL: https://cdn.amphenol-icc.com/media/wysiwyg/files/documentation/datasheet/inputoutput/io_usb_micro.pdf?src-supplier=TTI; ComponentLink14Description: https://cdn.amphenol-icc.com/media/wysiwyg/files/documentation/datasheet/inputoutput/io_usb_micro.pdf?src-supplier=TTI; ComponentLink15URL: https://cdn.amphenol-icc.com/media/wysiwyg/files/documentation/datasheet/inputoutput/io_usb_micro.pdf?src-supplier=NAC+Semi; ComponentLink15Description: https://cdn.amphenol-icc.com/media/wysiwyg/files/documentation/datasheet/inputoutput/io_usb_micro.pdf?src-supplier=NAC+Semi; ComponentLink16URL: https://cdn.amphenol-icc.com/media/wysiwyg/files/documentation/datasheet/inputoutput/io_usb_micro.pdf?src-supplier=SOS+electronic; ComponentLink16Description: https://cdn.amphenol-icc.com/media/wysiwyg/files/documentation/datasheet/inputoutput/io_usb_micro.pdf?src-supplier=SOS+electronic; ComponentLink17URL: https://cdn.amphenol-icc.com/media/wysiwyg/files/documentation/datasheet/inputoutput/io_usb_micro.pdf?src-supplier=Freelance+Electronics; ComponentLink17Description: https://cdn.amphenol-icc.com/media/wysiwyg/files/documentation/datasheet/inputoutput/io_usb_micro.pdf?src-supplier=Freelance+Electronics; ComponentLink18URL: https://cdn.amphenol-icc.com/media/wysiwyg/files/documentation/datasheet/inputoutput/io_usb_micro.pdf?src-supplier=Heilind+Electronics; ComponentLink18Description: https://cdn.amphenol-icc.com/media/wysiwyg/files/documentation/datasheet/inputoutput/io_usb_micro.pdf?src-supplier=Heilind+Electronics; Supplier Part Number 1: 609-4613-1-ND; Case/Package: Micro_Usb_B
X1 = CRYSTAL 32768kHZ: ABRACON - ABS05-32.768KHZ-T - Crystal, 32.768 kHz, SMD, 1.6mm x 1mm, 12.5 pF, 20 ppm, ABS05 Series; Designed By: İzzet Emre KARSAVURAN; Frequency Tolerance: 20ppm; Load Capacitance: 12.5pF; ESR (Equivalent Series Resistance): 90kR; Supplier 1: Digi-Key; Manufacturer: Abracon; Manufacturer Part Number: ABS05-32.768KHZ-T; RoHS: Yes; Category: Crystals; Stock 1: 64299; Pricing 1: 1=1,16000, 10=1,02500, 50=0,95760, 100=0,84630, 500=0,80180, 1000=0,66816 (USD); Mount: Surface Mount; Case/Package: SMD/SMT; Number of Pins: 2; Min Operating Temperature: -40°C; Max Operating Temperature: 85°C; Packaging: Tape and Reel; Package Quantity: 3000; Tolerance: 20ppm; Termination: SMD/SMT; Series Resistance: 90kR; Series: ABS05; Operating Frequency: 32.768 kHz; Length: 1.6mm; Width: 0.039inch; Height: 0.02inch; Depth: 1mm; Radiation Hardening: No; REACH SVHC: No SVHC; Lead Free: Lead Free; RoHS Compliant: Yes; ComponentLink1URL: https://datasheet.ciiva.com/23810/abs05-23810480.pdf?src-supplier=Newark; ComponentLink1Description: https://datasheet.ciiva.com/23810/abs05-23810480.pdf?src-supplier=Newark; ComponentLink2URL: https://datasheet.ciiva.com/6728/abs05-6728949.pdf?src-supplier=Digi-Key; ComponentLink2Description: https://datasheet.ciiva.com/6728/abs05-6728949.pdf?src-supplier=Digi-Key; ComponentLink3URL: https://datasheet.ciiva.com/6728/abs05-6728950.pdf?src-supplier=Digi-Key; ComponentLink3Description: https://datasheet.ciiva.com/6728/abs05-6728950.pdf?src-supplier=Digi-Key; ComponentLink4URL: https://datasheet.ciiva.com/16411/abs05-16411149.pdf?src-supplier=Future+Electronics; ComponentLink4Description: https://datasheet.ciiva.com/16411/abs05-16411149.pdf?src-supplier=Future+Electronics; Supplier Part Number 1: 535-11899-1-ND